# EAGLE design Zocalo DS1305 RTC (EAGLE 4.16)
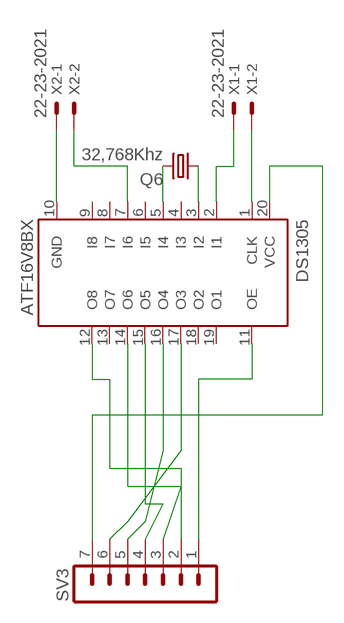
[diagram p0: schematic, sheet 1]

## Parts
DS1305  ATF16V8BX  [TSSOP20]
Q6  32,768Khz  CRYSTALTC26V  [TC26V]
SV3  MA07-1  [MA07-1]
X1  22-23-2021  [22-23-2021]
X2  22-23-2021  [22-23-2021]

## Nets
N$1: DS1305.1(CLK) X1.2
N$2: DS1305.11(OE) SV3.1
N$3: DS1305.20(VCC) SV3.7
N$4: DS1305.10(GND) X2.1
N$35: DS1305.7(I6) X2.2
N$36: DS1305.12(O8) SV3.2
N$37: DS1305.14(O6) SV3.3
N$39: DS1305.16(O4) SV3.5
N$44: DS1305.15(O5) SV3.4
N$69: DS1305.2(I1) X1.1
N$70: DS1305.3(I2) Q6.1
N$71: DS1305.5(I4) Q6.2
VCC: DS1305.17(O3) SV3.6
Unconnected: DS1305.4(I3) DS1305.6(I5) DS1305.8(I7) DS1305.9(I8) DS1305.13(O7) DS1305.18(O2) DS1305.19(O1)

## Library data of the parts
DS1305 = atmel:ATF16V8B: High perfomance CMOS (electrically erasable) programmable logic device (PLD) ABLE-Atmel-ABEL - P18V8R, P16V8C, P16V8AS, P17V8 COPL Atmel-WinCUPL - G16V8MS, G16V8MA, G16V8AS, G16V8 LOG/IC - GAL16V8_R, GAL16V8_G7, GAL16V8_C), GAL16V8 Tango-PLD - G16V8R, G16V8C, G16V8AS, G16V8 Source: http://www.atmel.com/dyn/resources/prod_documents/DOC0364.PDF
Q6 = crystal:CRYSTAL: CRYSTAL
SV3 = con-lstb:MA07-1: PIN HEADER
X1 X2 = con-molex:22-23-2021: .100" (2.54mm) Center Header - 2 Pin

## Board
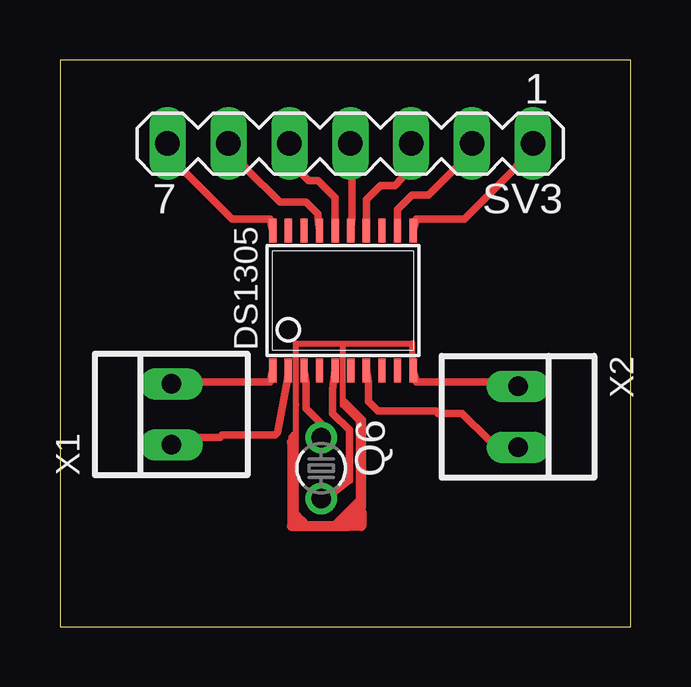
[diagram p1: board, top side]

Size 23.8 x 23.64 mm. Coordinates in mm from the lower left corner, seen from the top.
Outline: 0,0 23.8,0 23.8,23.64 0,23.64 0,0
Copper layers (1*16): Top 0.035mm / dielectric 1.5mm / Bottom 0.035mm
Design rules "default": minimum track width 12mil, minimum drill 24mil, track to track 2mil, track to pad 8mil, pad to pad 8mil, via to via 8mil, smd to smd 8mil, copper to edge 40mil, drill to drill 8mil, minimum pad ring 10mil, minimum via ring 8mil, stop-mask expansion 4mil, vias tented up to drill 0mil, thermal gap 10mil

### Footprints (pad centres in the part's own frame; a part is rotated, then mirrored left to right if it is on the bottom)
TSSOP20 = smd 0.305 x 0.991: 1 -2.925,-2.918; 2 -2.275,-2.918; 3 -1.625,-2.918; 4 -0.975,-2.918; 5 -0.325,-2.918; 6 0.325,-2.918; 7 0.975,-2.918; 8 1.625,-2.918; 9 2.275,-2.918; 10 2.925,-2.918; 11 2.925,2.918; 12 2.275,2.918; 13 1.625,2.918; 14 0.975,2.918; 15 0.325,2.918; 16 -0.325,2.918; 17 -0.975,2.918; 18 -1.625,2.918; 19 -2.275,2.918; 20 -2.925,2.918
TC26V = drill 0.813 round: 1 -1.27,0; 2 1.27,0
MA07-1 = drill 1.016 long: 1 -7.62,0; 2 -5.08,0; 3 -2.54,0; 4 0,0; 5 2.54,0; 6 5.08,0; 7 7.62,0
22-23-2021 = drill 0.813 long: 1 -1.27,0; 2 1.27,0

### Placement (x,y rotation side)
DS1305  11.8,13.61 0 top
Q6  10.89,6.62 270 top
SV3  12.1,20.15 180 top
X1  4.64,8.86 90 top
X2  19.1,8.76 270 top

### Tracks (layer width: path | path; a pad name or v marks a point on that pad's centre or on a via)
N$1
  Top 0.305: DS1305.1 8.77,10.21 5.87,10.21 X1.2
N$2
  Top 0.305: DS1305.11 14.87,17.01 16.87,17.01 18.97,19.11 SV3.1
N$3
  Top 0.305: DS1305.20 8.77,17.01 7.17,17.01 5.17,19.01 SV3.7
N$4
  Top 0.305: DS1305.10 14.87,10.21 17.87,10.21 X2.1
N$5
  Top 0.254: 9.88,11.77 9.84,11.77 9.84,9.28
N$6
  Top 0.305: 9.67,7.71 9.67,7.91 9.77,8.01
  Top 0.406: 9.67,7.71 9.67,4.21 11.77,4.21 12.57,5.01 12.57,8.61 11.87,9.31
N$7
  Top 0.254: 9.84,9.24 9.84,4.16 11.32,4.16 12.47,5.32 12.47,8.58 11.8,9.25 | 11.84,11.77 11.8,11.77 11.8,9.25 | 11.8,9.25 11.8,9.24
N$8
  Top 0.254: 14.68,10.78 14.68,11.82 9.83,11.82
N$9
  Top 0.406: 10.17,4.31 9.87,4.61
N$10
  Top 0.406: 12.57,4.81 12.57,4.21 11.97,4.21 | 11.87,4.21 11.97,4.21 | 11.97,4.21 12.27,4.51
N$35
  Top 0.305: DS1305.7 12.87,10.21 12.87,9.41 13.27,9.01 15.67,9.01 15.77,8.91 16.77,8.91 17.87,7.81 X2.2
N$36
  Top 0.305: SV3.2 17.19,19.82 15.37,18.01 14.67,18.01 14.07,17.41 14.07,16.51 14.08,16.52 DS1305.12
N$37
  Top 0.305: SV3.3 14.27,18.71 13.97,18.41 13.37,18.41 12.78,17.82 DS1305.14
N$39
  Top 0.305: SV3.5 9.56,19.42 10.37,18.61 10.77,18.61 11.47,17.91 11.47,16.61 DS1305.16
N$44
  Top 0.305: DS1305.15 12.17,17.01 12.17,18.71 SV3.4
N$69
  Top 0.305: DS1305.2 9.47,10.21 9.07,8.11 8.97,8.01 6.77,8.01 6.67,7.91 5.87,7.91 X1.1
N$70
  Top 0.305: DS1305.3 10.27,10.21 10.27,9.11 10.87,8.51 Q6.1
N$71
  Top 0.305: DS1305.5 11.37,9.91 11.37,8.91 12.07,8.21 12.07,6.11 11.07,5.31 Q6.2
VCC
  Top 0.305: DS1305.17 10.77,17.01 10.77,17.21 10.27,17.71 9.17,17.71 7.77,19.11 SV3.6